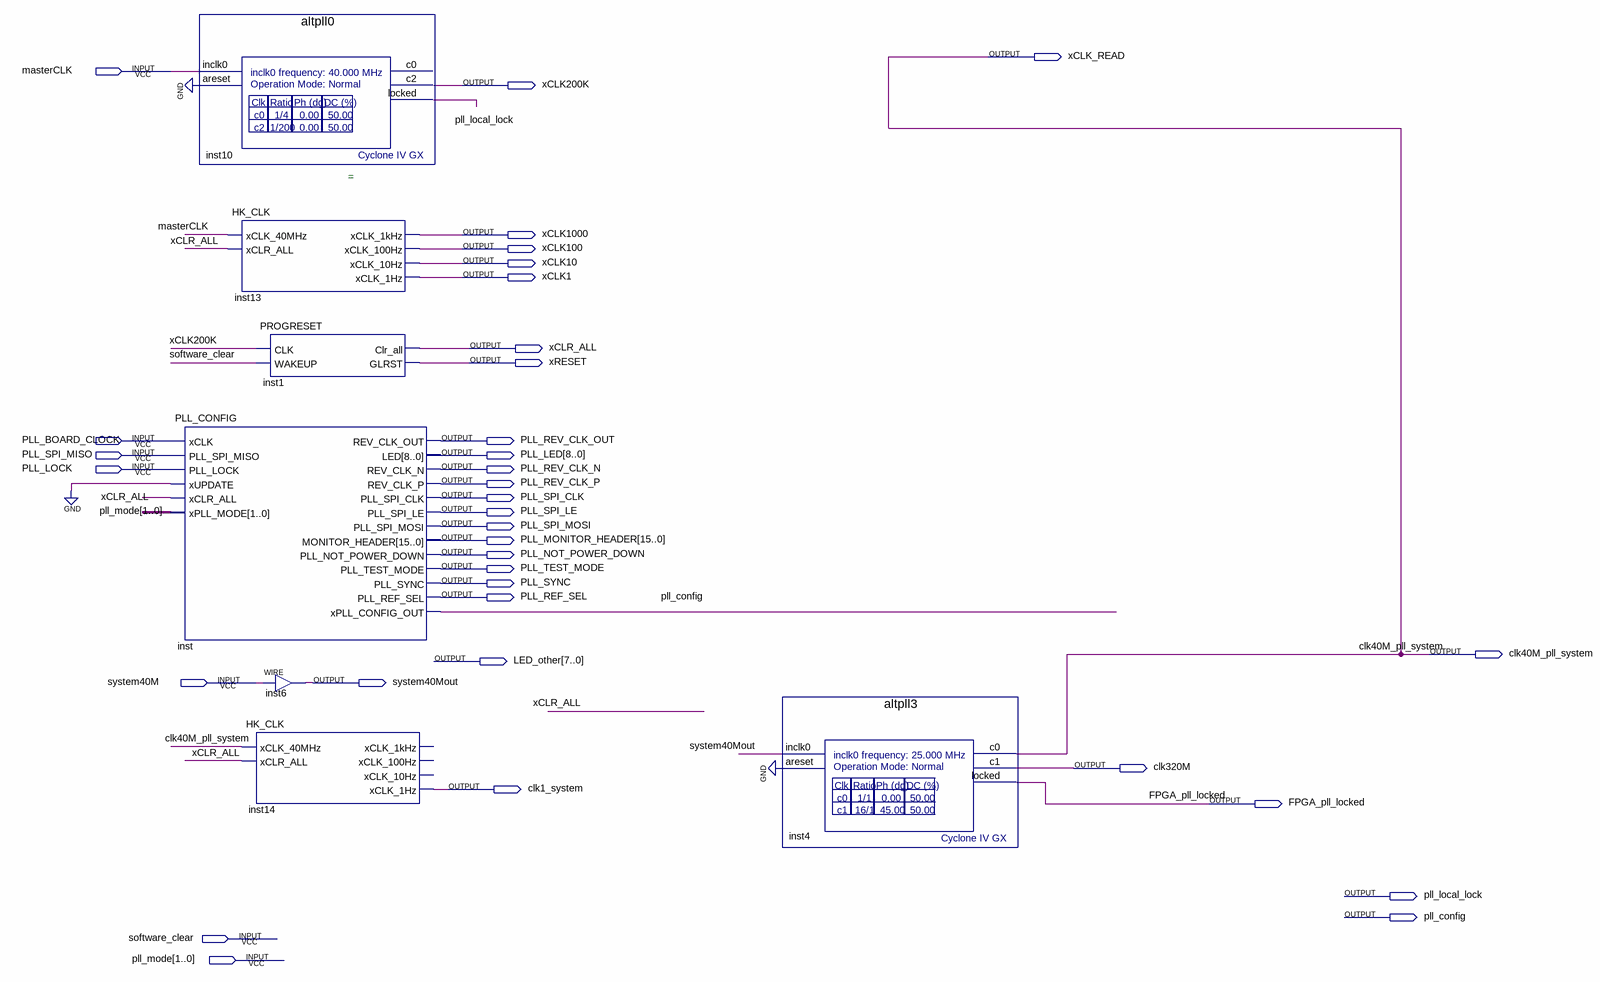
[diagram p0: schematic sheet]
// Quartus schematic CLKmain.bdf as structural Verilog: 7 symbols, 35 pins
module CLKmain (
  input  masterCLK,
  input  PLL_BOARD_CLOCK,
  input  PLL_SPI_MISO,
  input  PLL_LOCK,
  input  system40M,
  input  software_clear,
  input  [1:0] pll_mode,
  output xCLK_READ,
  output xCLK200K,
  output xCLK1000,
  output xCLK100,
  output xCLK10,
  output xCLK1,
  output xCLR_ALL,
  output xRESET,
  output PLL_REV_CLK_OUT,
  output [8:0] PLL_LED,
  output PLL_REV_CLK_N,
  output PLL_REV_CLK_P,
  output PLL_SPI_CLK,
  output PLL_SPI_LE,
  output PLL_SPI_MOSI,
  output [15:0] PLL_MONITOR_HEADER,
  output PLL_NOT_POWER_DOWN,
  output PLL_TEST_MODE,
  output PLL_SYNC,
  output PLL_REF_SEL,
  output clk40M_pll_system,
  output [7:0] LED_other,
  output system40Mout,
  output clk320M,
  output clk1_system,
  output FPGA_pll_locked,
  output pll_local_lock,
  output pll_config
);

  PLL_CONFIG inst (
    .xCLK(PLL_BOARD_CLOCK), .PLL_SPI_MISO(PLL_SPI_MISO), .PLL_LOCK(PLL_LOCK), .xUPDATE(1'b0),
    .xCLR_ALL(xCLR_ALL), .xPLL_MODE(pll_mode), .REV_CLK_OUT(PLL_REV_CLK_OUT), .LED(PLL_LED),
    .REV_CLK_N(PLL_REV_CLK_N), .REV_CLK_P(PLL_REV_CLK_P), .PLL_SPI_CLK(PLL_SPI_CLK), .PLL_SPI_LE(PLL_SPI_LE),
    .PLL_SPI_MOSI(PLL_SPI_MOSI), .MONITOR_HEADER(PLL_MONITOR_HEADER),
    .PLL_NOT_POWER_DOWN(PLL_NOT_POWER_DOWN), .PLL_TEST_MODE(PLL_TEST_MODE), .PLL_SYNC(PLL_SYNC),
    .PLL_REF_SEL(PLL_REF_SEL), .xPLL_CONFIG_OUT(pll_config));
  altpll0 inst10 (.inclk0(masterCLK), .areset(1'b0), .c2(xCLK200K), .locked(pll_local_lock));  // open: c0
  HK_CLK inst13 (
    .xCLK_40MHz(masterCLK), .xCLR_ALL(xCLR_ALL), .xCLK_1kHz(xCLK1000), .xCLK_100Hz(xCLK100),
    .xCLK_10Hz(xCLK10), .xCLK_1Hz(xCLK1));
  PROGRESET inst1 (.CLK(xCLK200K), .WAKEUP(software_clear), .Clr_all(xCLR_ALL), .GLRST(xRESET));
  assign system40Mout = system40M;  // WIRE inst6
  HK_CLK inst14 (
    .xCLK_40MHz(clk40M_pll_system), .xCLR_ALL(xCLR_ALL), .xCLK_1Hz(clk1_system));  // open: xCLK_1kHz, xCLK_100Hz, xCLK_10Hz
  altpll3 inst4 (.inclk0(system40Mout), .areset(1'b0), .c0(clk40M_pll_system), .c1(clk320M), .locked(FPGA_pll_locked));

  assign xCLK_READ = clk40M_pll_system;

  // Notes on the sheet:
  //   =
endmodule
